# Altium schematic sheet Project_Information.SchDoc: =project_title
size Tabloid; CompanyName: Luxonis Holding; Organization: Luxonis Holding; Address1: 1925 Harmony Park Drive; Address2: Westminster, CO; Address3: 80234; Address4: United States; DocumentNumber: 1; SheetNumber: 1; SheetTotal: 17
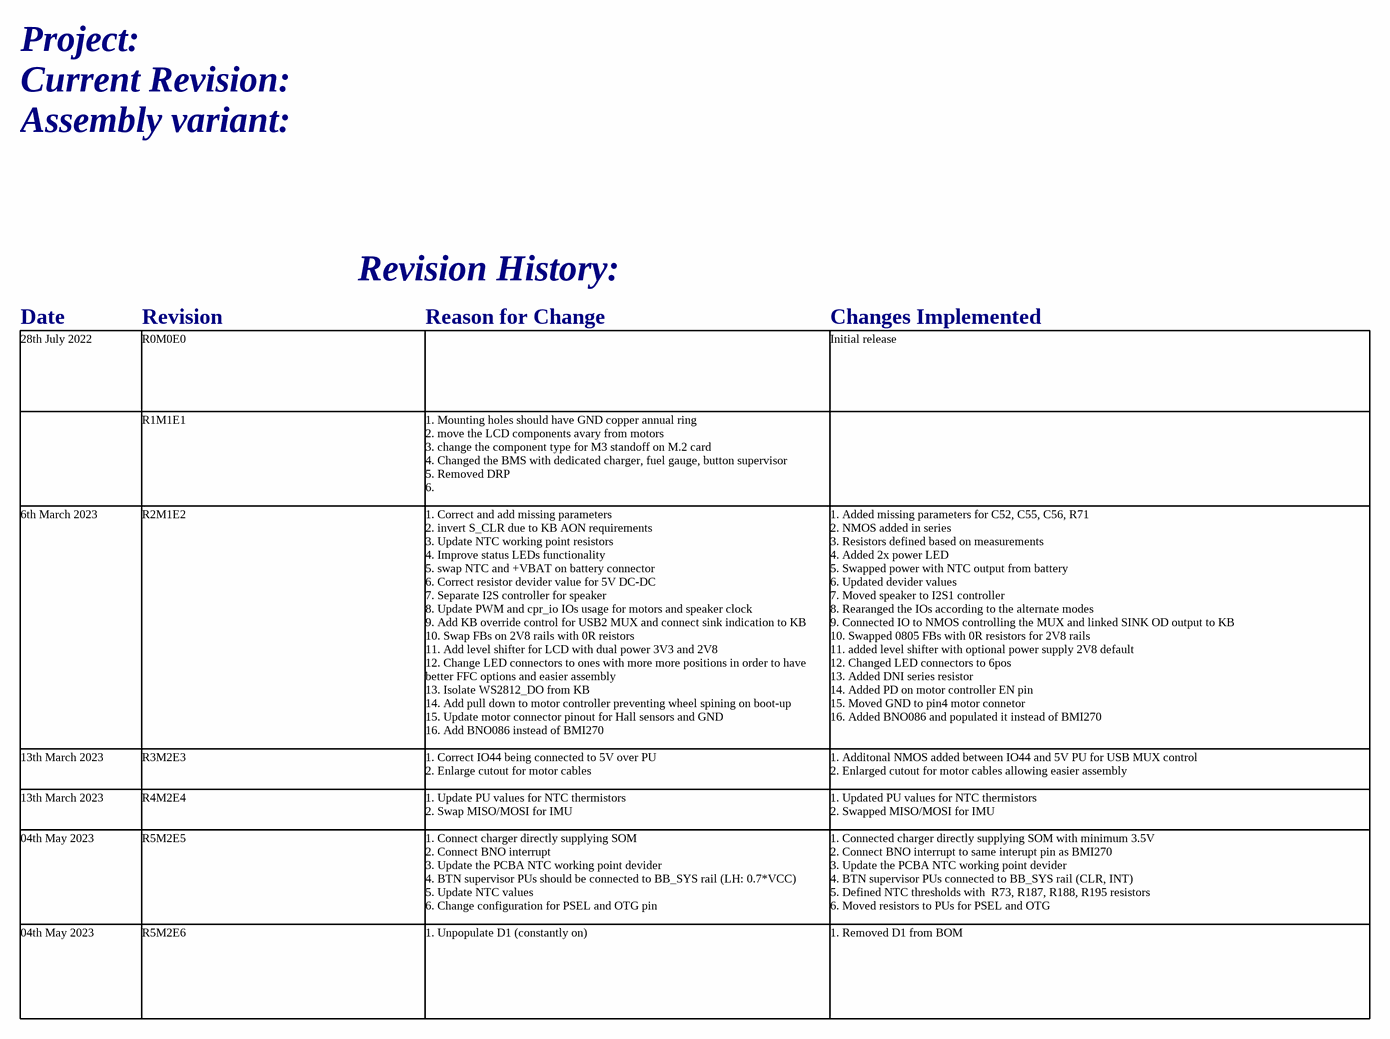
[diagram p0: Project_Information.SchDoc]

## Notes on the sheet
- Project:
- Current Revision:
- Assembly variant:
- Revision History:
- Date
- Revision
- Reason for Change
- Changes Implemented
- 28th July 2022
- R0M0E0
- Initial release
- R1M1E1
- 1. Mounting holes should have GND copper annual ring
  2. move the LCD components avary from motors
  3. change the component type for M3 standoff on M.2 card
  4. Changed the BMS with dedicated charger, fuel gauge, button supervisor
  5. Removed DRP
  6.
- 6th March 2023
- 13th March 2023
- R2M1E2
- R3M2E3
- 1. Correct and add missing parameters
  2. invert S_CLR due to KB AON requirements
  3. Update NTC working point resistors
  4. Improve status LEDs functionality
  5. swap NTC and +VBAT on battery connector
  6. Correct resistor devider value for 5V DC-DC
  7. Separate I2S controller for speaker
  8. Update PWM and cpr_io IOs usage for motors and speaker clock
  9. Add KB override control for USB2 MUX and connect sink indication to KB
  10. Swap FBs on 2V8 rails with 0R reistors
  11. Add level shifter for LCD with dual power 3V3 and 2V8
  12. Change LED connectors to ones with more more positions in order to have better FFC options and easier assembly
  13. Isolate WS2812_DO from KB
  14. Add pull down to motor controller preventing wheel spining on boot-up
  15. Update motor connector pinout for Hall sensors and GND
  16. Add BNO086 instead of BMI270
- 1. Correct IO44 being connected to 5V over PU
  2. Enlarge cutout for motor cables
- 1. Added missing parameters for C52, C55, C56, R71
  2. NMOS added in series
  3. Resistors defined based on measurements
  4. Added 2x power LED
  5. Swapped power with NTC output from battery
  6. Updated devider values
  7. Moved speaker to I2S1 controller
  8. Rearanged the IOs according to the alternate modes
  9. Connected IO to NMOS controlling the MUX and linked SINK OD output to KB
  10. Swapped 0805 FBs with 0R resistors for 2V8 rails
  11. added level shifter with optional power supply 2V8 default
  12. Changed LED connectors to 6pos
  13. Added DNI series resistor
  14. Added PD on motor controller EN pin
  15. Moved GND to pin4 motor connetor
  16. Added BNO086 and populated it instead of BMI270
- 1. Additonal NMOS added between IO44 and 5V PU for USB MUX control
  2. Enlarged cutout for motor cables allowing easier assembly
- R4M2E4
- 1. Update PU values for NTC thermistors
  2. Swap MISO/MOSI for IMU
- 1. Updated PU values for NTC thermistors
  2. Swapped MISO/MOSI for IMU
- 04th May 2023
- R5M2E5
- 1. Connect charger directly supplying SOM
  2. Connect BNO interrupt
  3. Update the PCBA NTC working point devider
  4. BTN supervisor PUs should be connected to BB_SYS rail (LH: 0.7*VCC)
  5. Update NTC values
  6. Change configuration for PSEL and OTG pin
- 1. Connected charger directly supplying SOM with minimum 3.5V
  2. Connect BNO interrupt to same interupt pin as BMI270
  3. Update the PCBA NTC working point devider
  4. BTN supervisor PUs connected to BB_SYS rail (CLR, INT)
  5. Defined NTC thresholds with  R73, R187, R188, R195 resistors
  6. Moved resistors to PUs for PSEL and OTG
- R5M2E6
- 1. Unpopulate D1 (constantly on)
- 1. Removed D1 from BOM
- Title
- Size:
- Date:
- Tabloid
- Number:
- Time:
- Revision:
- Sheet
- of
- Drawn by: